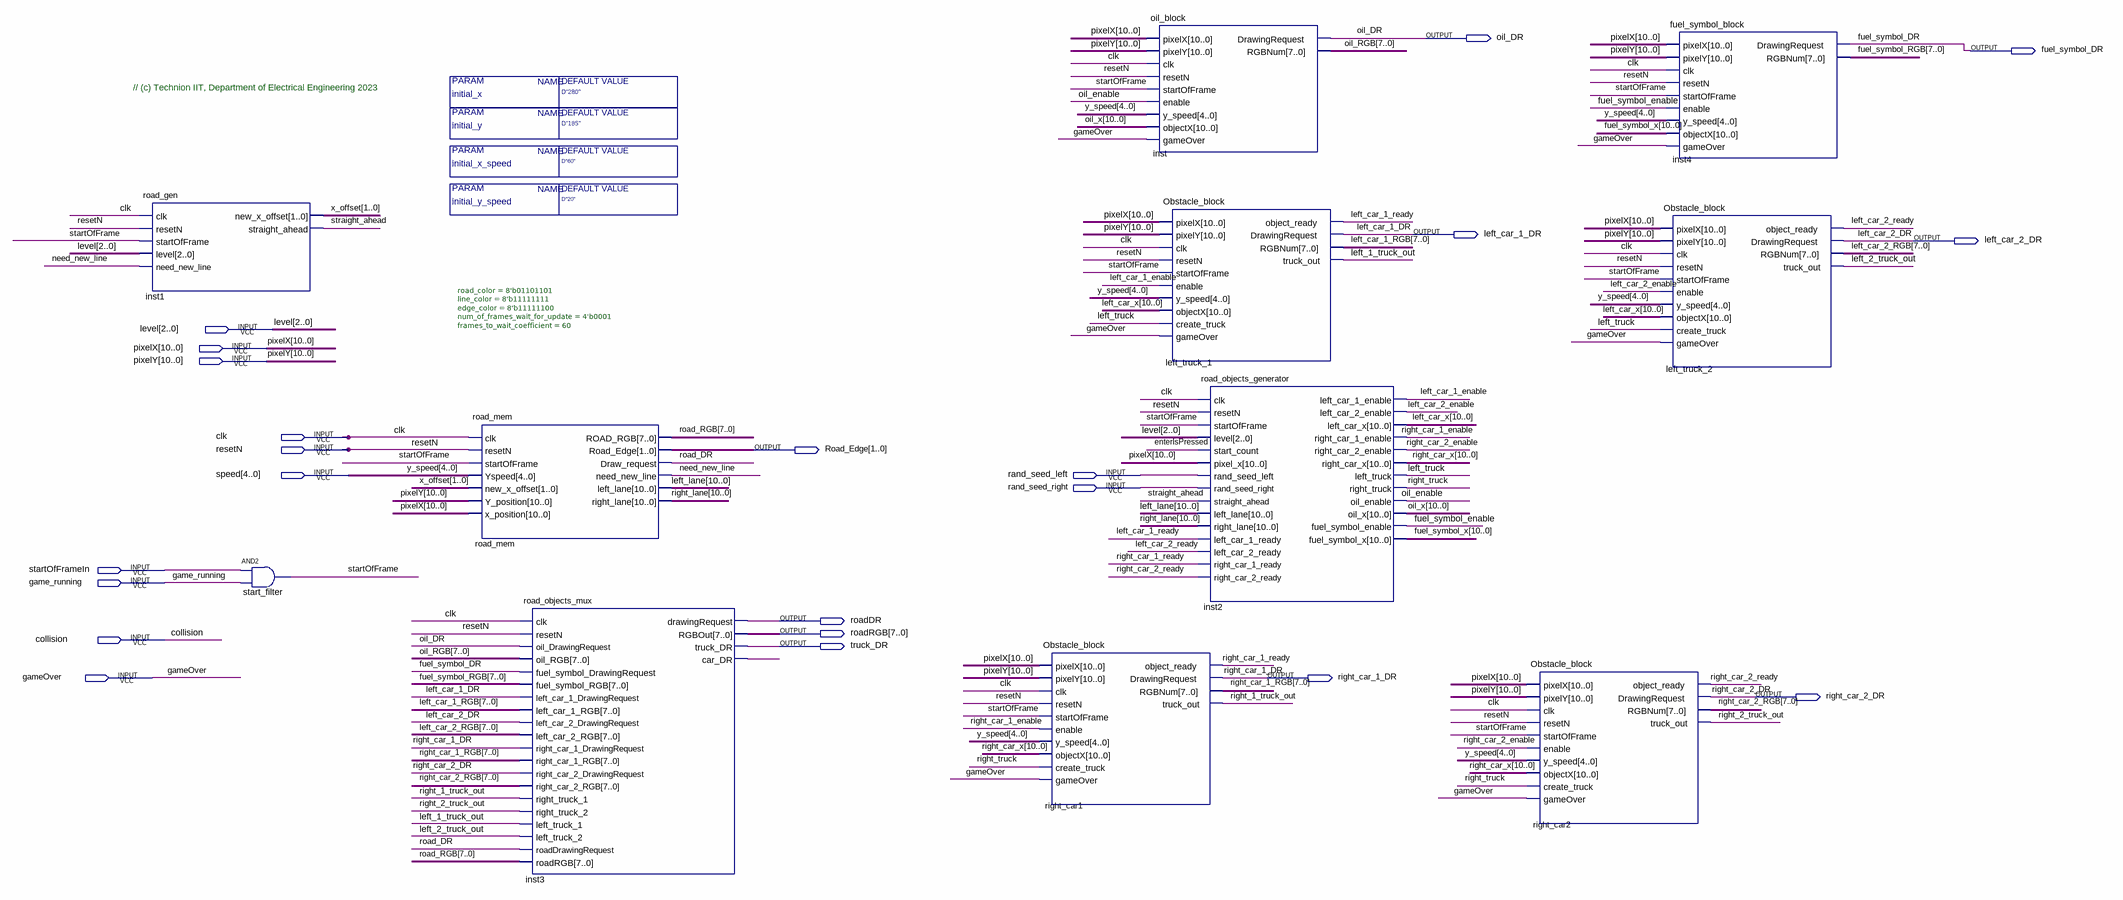
[diagram p0: schematic sheet]
// Quartus schematic Road_Block.bdf as structural Verilog: 11 symbols, 22 pins
module Road_Block #(parameter initial_x = "D\"280\"", parameter initial_y = "D\"185\"", parameter initial_x_speed = "D\"60\"", parameter initial_y_speed = "D\"20\"") (
  input  [2:0] level,
  input  [10:0] pixelX,
  input  [10:0] pixelY,
  input  clk,
  input  resetN,
  input  [4:0] speed,
  input  rand_seed_left,
  input  rand_seed_right,
  input  startOfFrameIn,
  input  game_running,
  input  collision,
  input  gameOver,
  output oil_DR,
  output fuel_symbol_DR,
  output left_car_1_DR,
  output left_car_2_DR,
  output [1:0] Road_Edge,
  output roadDR,
  output [7:0] roadRGB,
  output truck_DR,
  output right_car_1_DR,
  output right_car_2_DR
);

  wire enterIsPressed, fuel_symbol_enable, inst3_car_dr, left_1_truck_out, left_2_truck_out,
       left_car_1_enable, left_car_1_ready, left_car_2_enable, left_car_2_ready, left_truck, need_new_line,
       oil_enable, right_1_truck_out, right_2_truck_out, right_car_1_enable, right_car_1_ready,
       right_car_2_enable, right_car_2_ready, right_truck, road_DR, startOfFrame, straight_ahead;
  wire [1:0] x_offset;
  wire [7:0] fuel_symbol_RGB, left_car_1_RGB, left_car_2_RGB, oil_RGB, right_car_1_RGB, right_car_2_RGB,
       road_RGB;
  wire [10:0] fuel_symbol_x, left_car_x, left_lane, oil_x, right_car_x, right_lane;

  road_gen inst1 (
    .clk(clk), .resetN(resetN), .startOfFrame(startOfFrame), .level(level), .need_new_line(need_new_line),
    .new_x_offset(x_offset), .straight_ahead(straight_ahead));
  and start_filter (startOfFrame, startOfFrameIn, game_running);
  road_mem #(.road_color(8'b01101101), .line_color(8'b11111111), .edge_color(8'b11111100), .num_of_frames_wait_for_update(4'b0001), .frames_to_wait_coefficient(60)) road_mem (
    .clk(clk), .resetN(resetN), .startOfFrame(startOfFrame), .Yspeed(speed), .new_x_offset(x_offset),
    .Y_position(pixelY), .x_position(pixelX), .ROAD_RGB(road_RGB), .Road_Edge(Road_Edge),
    .Draw_request(road_DR), .need_new_line(need_new_line), .left_lane(left_lane), .right_lane(right_lane));
  road_objects_mux inst3 (
    .clk(clk), .resetN(resetN), .oil_DrawingRequest(oil_DR), .oil_RGB(oil_RGB),
    .fuel_symbol_DrawingRequest(fuel_symbol_DR), .fuel_symbol_RGB(fuel_symbol_RGB),
    .left_car_1_DrawingRequest(left_car_1_DR), .left_car_1_RGB(left_car_1_RGB),
    .left_car_2_DrawingRequest(left_car_2_DR), .left_car_2_RGB(left_car_2_RGB),
    .right_car_1_DrawingRequest(right_car_1_DR), .right_car_1_RGB(right_car_1_RGB),
    .right_car_2_DrawingRequest(right_car_2_DR), .right_car_2_RGB(right_car_2_RGB),
    .right_truck_1(right_1_truck_out), .right_truck_2(right_2_truck_out), .left_truck_1(left_1_truck_out),
    .left_truck_2(left_2_truck_out), .roadDrawingRequest(road_DR), .roadRGB(road_RGB),
    .drawingRequest(roadDR), .RGBOut(roadRGB), .truck_DR(truck_DR), .car_DR(inst3_car_dr));
  Obstacle_block right_car1 (
    .pixelX(pixelX), .pixelY(pixelY), .clk(clk), .resetN(resetN), .startOfFrame(startOfFrame),
    .enable(right_car_1_enable), .y_speed(speed), .objectX(right_car_x), .create_truck(right_truck),
    .gameOver(gameOver), .object_ready(right_car_1_ready), .DrawingRequest(right_car_1_DR),
    .RGBNum(right_car_1_RGB), .truck_out(right_1_truck_out));
  oil_block inst (
    .pixelX(pixelX), .pixelY(pixelY), .clk(clk), .resetN(resetN), .startOfFrame(startOfFrame),
    .enable(oil_enable), .y_speed(speed), .objectX(oil_x), .gameOver(gameOver), .DrawingRequest(oil_DR),
    .RGBNum(oil_RGB));
  Obstacle_block left_truck_1 (
    .pixelX(pixelX), .pixelY(pixelY), .clk(clk), .resetN(resetN), .startOfFrame(startOfFrame),
    .enable(left_car_1_enable), .y_speed(speed), .objectX(left_car_x), .create_truck(left_truck),
    .gameOver(gameOver), .object_ready(left_car_1_ready), .DrawingRequest(left_car_1_DR),
    .RGBNum(left_car_1_RGB), .truck_out(left_1_truck_out));
  road_objects_generator inst2 (
    .clk(clk), .resetN(resetN), .startOfFrame(startOfFrame), .level(level), .start_count(enterIsPressed),
    .pixel_x(pixelX), .rand_seed_left(rand_seed_left), .rand_seed_right(rand_seed_right),
    .straight_ahead(straight_ahead), .left_lane(left_lane), .right_lane(right_lane),
    .left_car_1_ready(left_car_1_ready), .left_car_2_ready(left_car_2_ready),
    .right_car_1_ready(right_car_1_ready), .right_car_2_ready(right_car_2_ready),
    .left_car_1_enable(left_car_1_enable), .left_car_2_enable(left_car_2_enable), .left_car_x(left_car_x),
    .right_car_1_enable(right_car_1_enable), .right_car_2_enable(right_car_2_enable),
    .right_car_x(right_car_x), .left_truck(left_truck), .right_truck(right_truck), .oil_enable(oil_enable),
    .oil_x(oil_x), .fuel_symbol_enable(fuel_symbol_enable), .fuel_symbol_x(fuel_symbol_x));
  Obstacle_block right_car2 (
    .pixelX(pixelX), .pixelY(pixelY), .clk(clk), .resetN(resetN), .startOfFrame(startOfFrame),
    .enable(right_car_2_enable), .y_speed(speed), .objectX(right_car_x), .create_truck(right_truck),
    .gameOver(gameOver), .object_ready(right_car_2_ready), .DrawingRequest(right_car_2_DR),
    .RGBNum(right_car_2_RGB), .truck_out(right_2_truck_out));
  fuel_symbol_block inst4 (
    .pixelX(pixelX), .pixelY(pixelY), .clk(clk), .resetN(resetN), .startOfFrame(startOfFrame),
    .enable(fuel_symbol_enable), .y_speed(speed), .objectX(fuel_symbol_x), .gameOver(gameOver),
    .DrawingRequest(fuel_symbol_DR), .RGBNum(fuel_symbol_RGB));
  Obstacle_block left_truck_2 (
    .pixelX(pixelX), .pixelY(pixelY), .clk(clk), .resetN(resetN), .startOfFrame(startOfFrame),
    .enable(left_car_2_enable), .y_speed(speed), .objectX(left_car_x), .create_truck(left_truck),
    .gameOver(gameOver), .object_ready(left_car_2_ready), .DrawingRequest(left_car_2_DR),
    .RGBNum(left_car_2_RGB), .truck_out(left_2_truck_out));

  // Other names for the same wires on the sheet: y_speed[4:0] = speed

  // Notes on the sheet:
  //   // (c) Technion IIT, Department of Electrical Engineering 2023
endmodule
